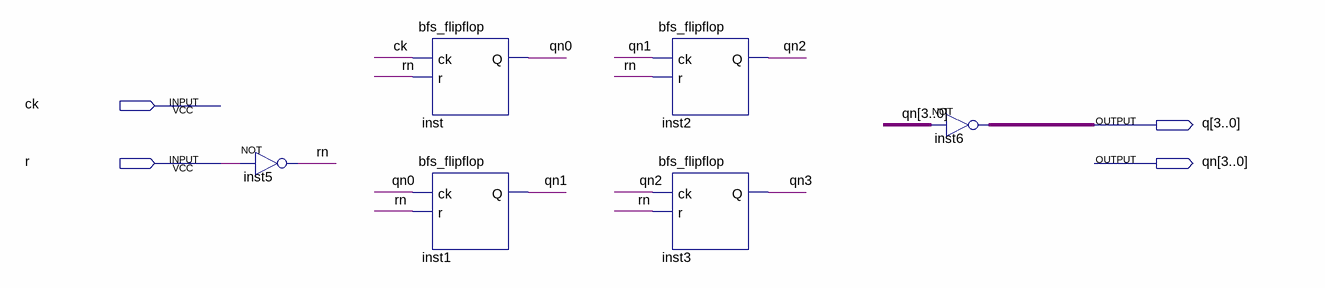
[diagram p0: schematic sheet]
// Quartus schematic bfs_flipflop4.bdf as structural Verilog: 6 symbols, 4 pins
module bfs_flipflop4 (
  input  ck,
  input  r,
  output [3:0] q,
  output [3:0] qn
);

  wire rn;

  not inst5 (rn, r);
  bfs_flipflop inst (.ck(ck), .r(rn), .Q(qn[0]));
  bfs_flipflop inst1 (.ck(qn[0]), .r(rn), .Q(qn[1]));
  bfs_flipflop inst2 (.ck(qn[1]), .r(rn), .Q(qn[2]));
  bfs_flipflop inst3 (.ck(qn[2]), .r(rn), .Q(qn[3]));
  assign q = ~qn;  // NOT inst6, 4 bits wide
endmodule
